# Altium schematic sheet PS_Controle_ADC-LED.SchDoc
size 449 x 320 mm
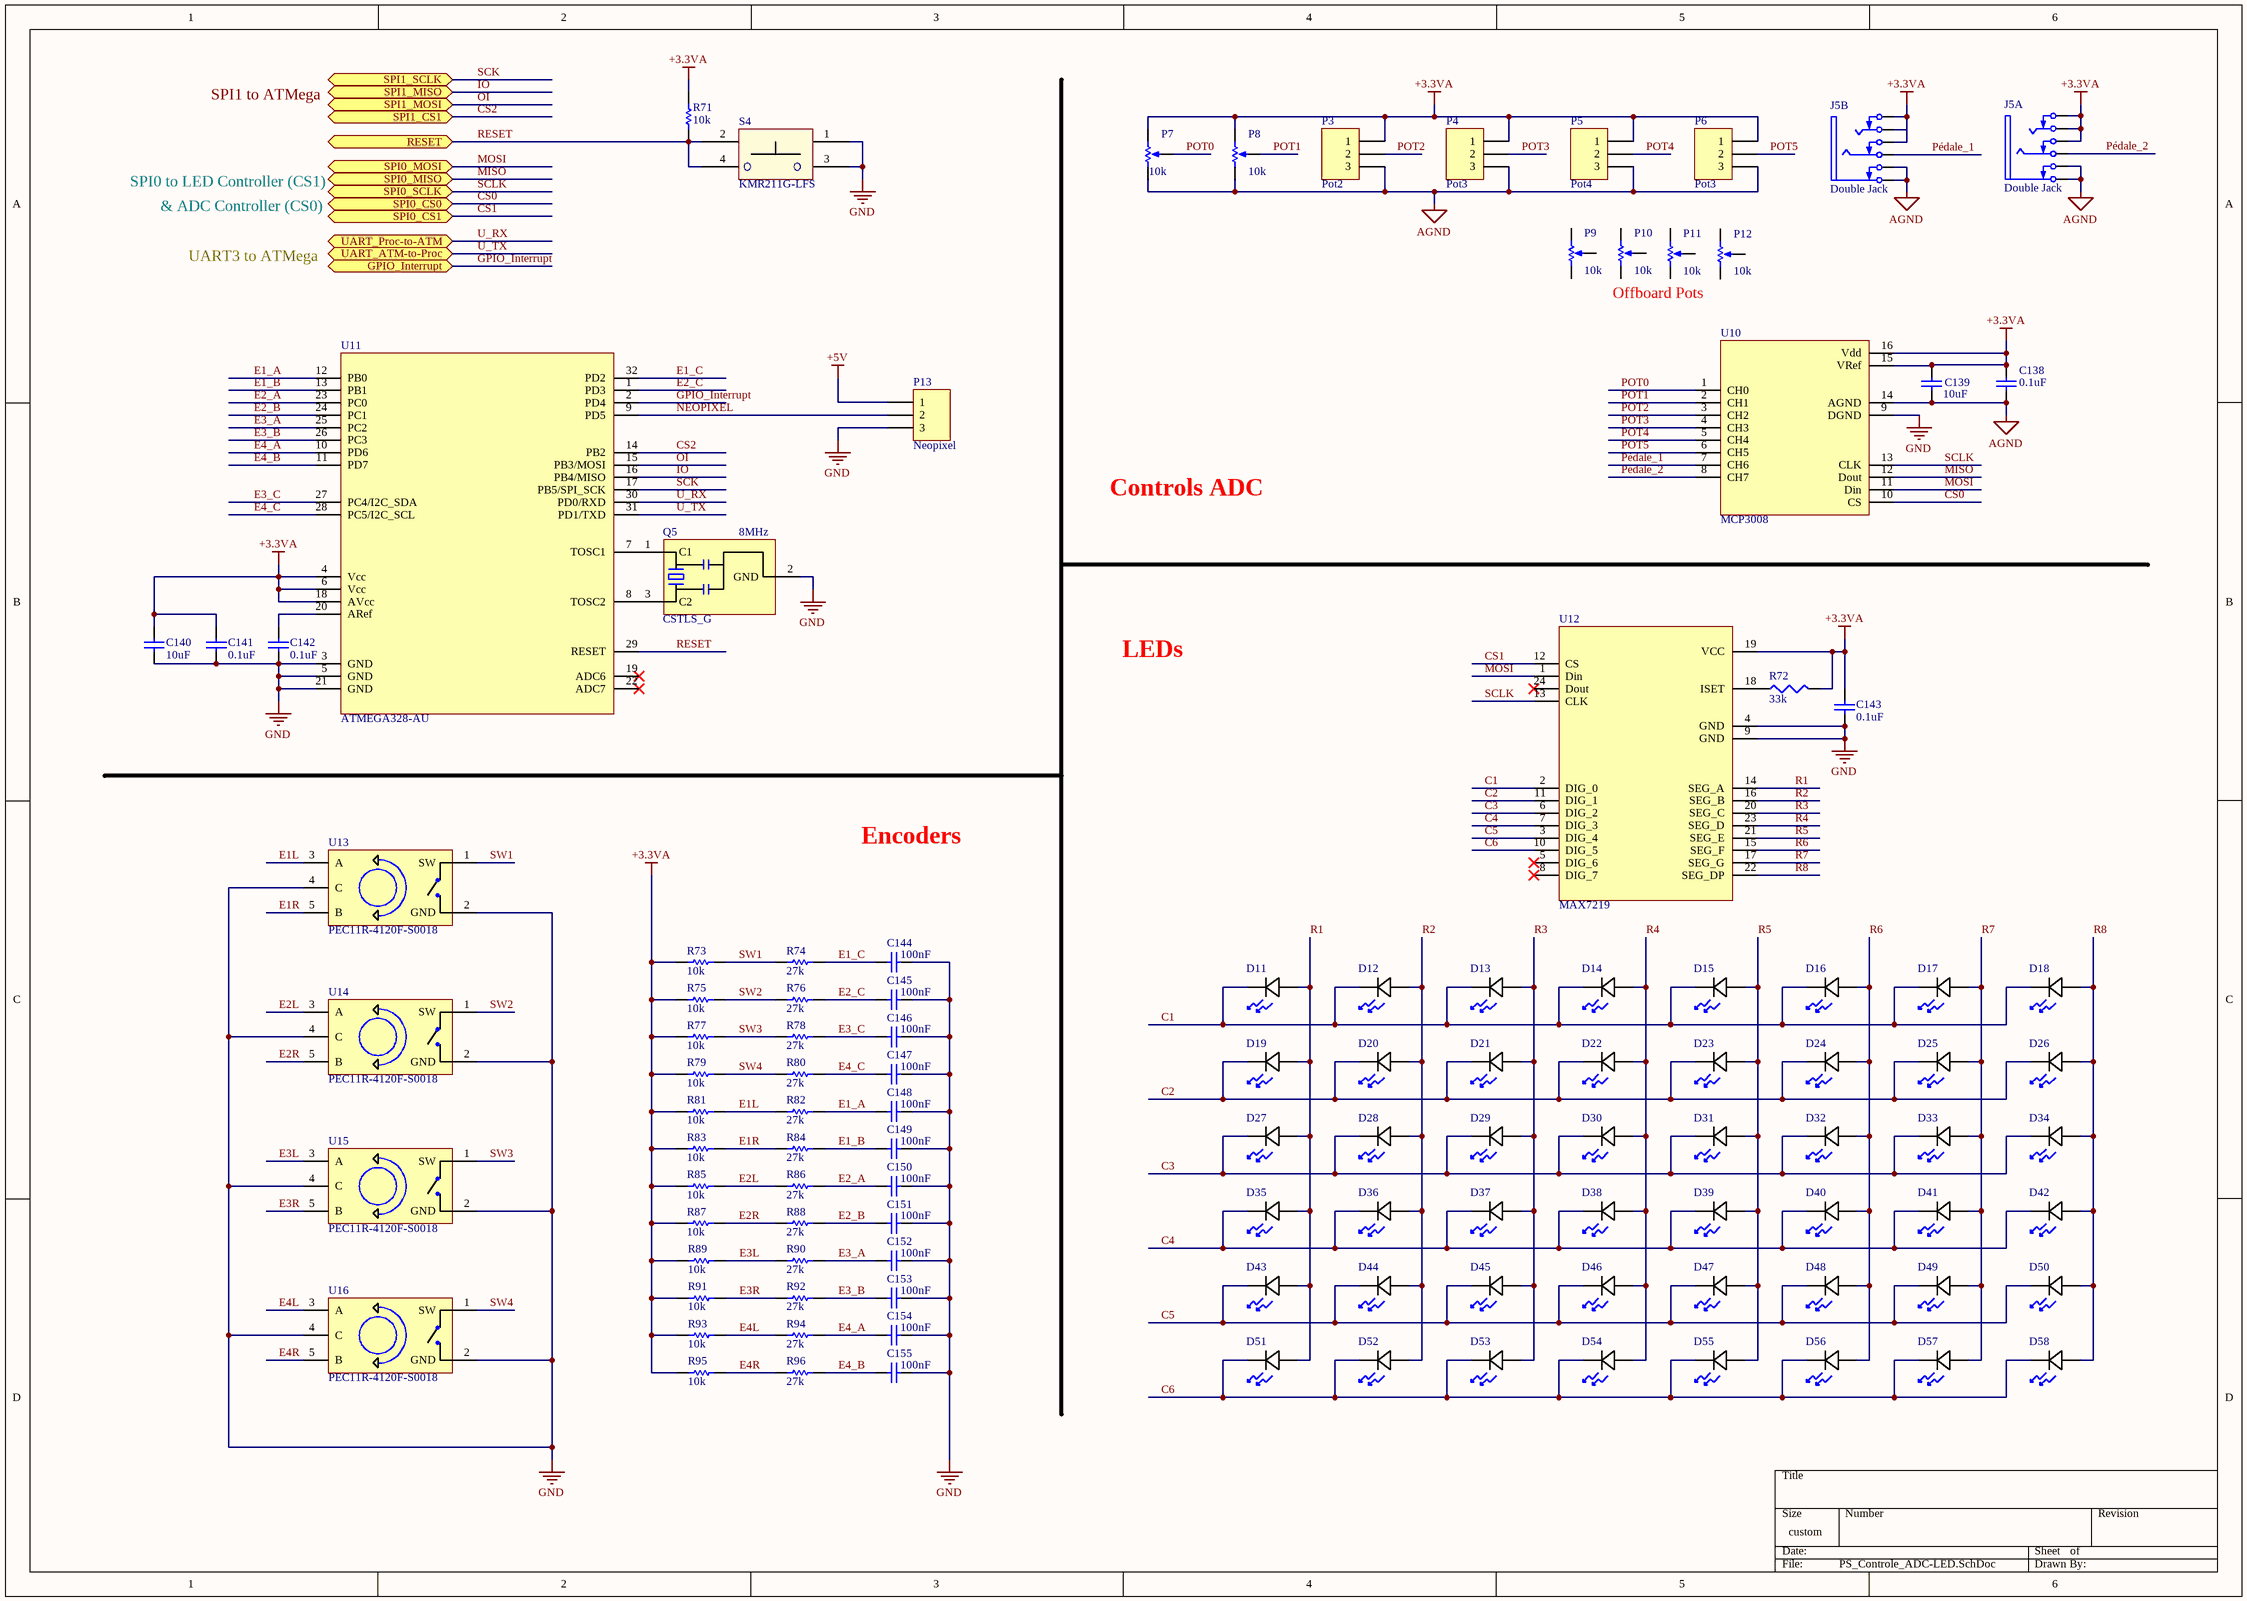
[diagram p0: PS_Controle_ADC-LED.SchDoc]

## Parts
C138  0.1uF  [CAPC1608X08]
C139  10uF  [CAPC1608X08]
C140  value 10uF  [CAPC1608X08]  (hidden comment: Cap)
C141  value 0.1uF  [CAPC1608X08]  (hidden comment: Cap)
C142  value 0.1uF  [CAPC1608X08]  (hidden comment: Cap)
C143  value 0.1uF  [CAPC1608X08]  (hidden comment: Cap)
C144  value 100nF  [CAPC1608X08]  (hidden comment: Cap)
C145  value 100nF  [CAPC1608X08]  (hidden comment: Cap)
C146  value 100nF  [CAPC1608X08]  (hidden comment: Cap)
C147  value 100nF  [CAPC1608X08]  (hidden comment: Cap)
C148  value 100nF  [CAPC1608X08]  (hidden comment: Cap)
C149  value 100nF  [CAPC1608X08]  (hidden comment: Cap)
C150  value 100nF  [CAPC1608X08]  (hidden comment: Cap)
C151  value 100nF  [CAPC1608X08]  (hidden comment: Cap)
C152  value 100nF  [CAPC1608X08]  (hidden comment: Cap)
C153  value 100nF  [CAPC1608X08]  (hidden comment: Cap)
C154  value 100nF  [CAPC1608X08]  (hidden comment: Cap)
C155  value 100nF  [CAPC1608X08]  (hidden comment: Cap)
D11  LNJ937W8CRA  [LED_LNJ]  (value not drawn)
D12  LNJ937W8CRA  [LED_LNJ]  (value not drawn)
D13  LNJ937W8CRA  [LED_LNJ]  (value not drawn)
D14  LNJ937W8CRA  [LED_LNJ]  (value not drawn)
D15  LNJ937W8CRA  [LED_LNJ]  (value not drawn)
D16  LNJ937W8CRA  [LED_LNJ]  (value not drawn)
D17  LNJ937W8CRA  [LED_LNJ]  (value not drawn)
D18  LNJ937W8CRA  [LED_LNJ]  (value not drawn)
D19  LNJ937W8CRA  [LED_LNJ]  (value not drawn)
D20  LNJ937W8CRA  [LED_LNJ]  (value not drawn)
D21  LNJ937W8CRA  [LED_LNJ]  (value not drawn)
D22  LNJ937W8CRA  [LED_LNJ]  (value not drawn)
D23  LNJ937W8CRA  [LED_LNJ]  (value not drawn)
D24  LNJ937W8CRA  [LED_LNJ]  (value not drawn)
D25  LNJ937W8CRA  [LED_LNJ]  (value not drawn)
D26  LNJ937W8CRA  [LED_LNJ]  (value not drawn)
D27  LNJ937W8CRA  [LED_LNJ]  (value not drawn)
D28  LNJ937W8CRA  [LED_LNJ]  (value not drawn)
D29  LNJ937W8CRA  [LED_LNJ]  (value not drawn)
D30  LNJ937W8CRA  [LED_LNJ]  (value not drawn)
D31  LNJ937W8CRA  [LED_LNJ]  (value not drawn)
D32  LNJ937W8CRA  [LED_LNJ]  (value not drawn)
D33  LNJ937W8CRA  [LED_LNJ]  (value not drawn)
D34  LNJ937W8CRA  [LED_LNJ]  (value not drawn)
D35  LNJ937W8CRA  [LED_LNJ]  (value not drawn)
D36  LNJ937W8CRA  [LED_LNJ]  (value not drawn)
D37  LNJ937W8CRA  [LED_LNJ]  (value not drawn)
D38  LNJ937W8CRA  [LED_LNJ]  (value not drawn)
D39  LNJ937W8CRA  [LED_LNJ]  (value not drawn)
D40  LNJ937W8CRA  [LED_LNJ]  (value not drawn)
D41  LNJ937W8CRA  [LED_LNJ]  (value not drawn)
D42  LNJ937W8CRA  [LED_LNJ]  (value not drawn)
D43  LNJ937W8CRA  [LED_LNJ]  (value not drawn)
D44  LNJ937W8CRA  [LED_LNJ]  (value not drawn)
D45  LNJ937W8CRA  [LED_LNJ]  (value not drawn)
D46  LNJ937W8CRA  [LED_LNJ]  (value not drawn)
D47  LNJ937W8CRA  [LED_LNJ]  (value not drawn)
D48  LNJ937W8CRA  [LED_LNJ]  (value not drawn)
D49  LNJ937W8CRA  [LED_LNJ]  (value not drawn)
D50  LNJ937W8CRA  [LED_LNJ]  (value not drawn)
D51  LNJ937W8CRA  [LED_LNJ]  (value not drawn)
D52  LNJ937W8CRA  [LED_LNJ]  (value not drawn)
D53  LNJ937W8CRA  [LED_LNJ]  (value not drawn)
D54  LNJ937W8CRA  [LED_LNJ]  (value not drawn)
D55  LNJ937W8CRA  [LED_LNJ]  (value not drawn)
D56  LNJ937W8CRA  [LED_LNJ]  (value not drawn)
D57  LNJ937W8CRA  [LED_LNJ]  (value not drawn)
D58  LNJ937W8CRA  [LED_LNJ]  (value not drawn)
J5  Double Jack  [Amphenol_ACJS-MHDC]  (parts A,B of 2)
P3  Pot2  [CONN_1241150-3_T]
P4  Pot3  [CONN_1241150-3_T]
P5  Pot4  [CONN_1241150-3_T]
P6  Pot3  [CONN_1241150-3_T]
P7  value 10k  [ALPS_RK09K1130C79]  (hidden comment: RPot)
P8  value 10k  [ALPS_RK09K1130C79]  (hidden comment: RPot)
P9  value 10k  (hidden comment: RPot)
P10  value 10k  (hidden comment: RPot)
P11  value 10k  (hidden comment: RPot)
P12  value 10k  (hidden comment: RPot)
P13  Neopixel  [CONN_1241150-3_T]
Q5  CSTLS_G  value 8MHz  [CSTCC_G]
R71  value 10k  [RESC1608X05]  (hidden comment: Res1)
R72  33k  [RESC1608X05]
R73  value 10k  [RESC1608X05]  (hidden comment: Res1)
R74  value 27k  [RESC1608X05]  (hidden comment: Res1)
R75  value 10k  [RESC1608X05]  (hidden comment: Res1)
R76  value 27k  [RESC1608X05]  (hidden comment: Res1)
R77  value 10k  [RESC1608X05]  (hidden comment: Res1)
R78  value 27k  [RESC1608X05]  (hidden comment: Res1)
R79  value 10k  [RESC1608X05]  (hidden comment: Res1)
R80  value 27k  [RESC1608X05]  (hidden comment: Res1)
R81  value 10k  [RESC1608X05]  (hidden comment: Res1)
R82  value 27k  [RESC1608X05]  (hidden comment: Res1)
R83  value 10k  [RESC1608X05]  (hidden comment: Res1)
R84  value 27k  [RESC1608X05]  (hidden comment: Res1)
R85  value 10k  [RESC1608X05]  (hidden comment: Res1)
R86  value 27k  [RESC1608X05]  (hidden comment: Res1)
R87  value 10k  [RESC1608X05]  (hidden comment: Res1)
R88  value 27k  [RESC1608X05]  (hidden comment: Res1)
R89  value 10k  [RESC1608X05]  (hidden comment: Res1)
R90  value 27k  [RESC1608X05]  (hidden comment: Res1)
R91  value 10k  [RESC1608X05]  (hidden comment: Res1)
R92  value 27k  [RESC1608X05]  (hidden comment: Res1)
R93  value 10k  [RESC1608X05]  (hidden comment: Res1)
R94  value 27k  [RESC1608X05]  (hidden comment: Res1)
R95  value 10k  [RESC1608X05]  (hidden comment: Res1)
R96  value 27k  [RESC1608X05]  (hidden comment: Res1)
S4  KMR211G-LFS  [C&K_KMR211G]
U10  MCP3008  [SOIC16_MCP3008]
U11  ATMEGA328-AU  [32A-M]
U12  MAX7219  [21-0042B_24-M]
U13  PEC11R-4120F-S0018  [BOURNS_PEC11R-4120F-S0018]
U14  PEC11R-4120F-S0018  [BOURNS_PEC11R-4120F-S0018]
U15  PEC11R-4120F-S0018  [BOURNS_PEC11R-4120F-S0018]
U16  PEC11R-4120F-S0018  [BOURNS_PEC11R-4120F-S0018]

## Ports
GPIO_Interrupt, RESET, SPI0_CS0, SPI0_CS1, SPI0_MISO, SPI0_MOSI, SPI0_SCLK, SPI1_CS1, SPI1_MISO, SPI1_MOSI, SPI1_SCLK, UART_ATM-to-Proc, UART_Proc-to-ATM

## Nets
+3.3VA: C138.1 C139.1 C140.1 C141.1 C143.1 J5.2(RB) J5.3(TB) J5.6(T) J5.8(RB) J5.9(TB) J5.12(T) P3.1 P4.1 P5.1 P6.1 P7.2(BOT) P8.2(BOT) R71.1 R72.2 R73.1 R75.1 R77.1 R79.1 R81.1 R83.1 R85.1 R87.1 R89.1 R91.1 R93.1 R95.1 U10.15(VRef) U10.16(Vdd) U11.4(Vcc) U11.6(Vcc) U11.18(AVcc) U12.19(VCC)
+5V: P13.1
AGND: C138.2 C139.2 J5.1(SB) J5.4(S) J5.7(SB) J5.10(S) P3.3 P4.3 P5.3 P6.3 P7.1(TOP) P8.1(TOP) U10.14(AGND)
GND: C140.2 C141.2 C142.2 C143.2 C144.1 C145.1 C146.1 C147.1 C148.1 C149.1 C150.1 C151.1 C152.1 C153.1 C154.1 C155.1 P13.3 Q5.2(GND) S4.1 S4.3 U10.9(DGND) U11.3(GND) U11.5(GND) U11.21(GND) U12.4(GND) U12.9(GND) U13.2(GND) U13.4(C) U14.2(GND) U14.4(C) U15.2(GND) U15.4(C) U16.2(GND) U16.4(C)
C1: D11.1 D12.1 D13.1 D14.1 D15.1 D16.1 D17.1 D18.1 U12.2(DIG_0)
C2: D19.1 D20.1 D21.1 D22.1 D23.1 D24.1 D25.1 D26.1 U12.11(DIG_1)
C3: D27.1 D28.1 D29.1 D30.1 D31.1 D32.1 D33.1 D34.1 U12.6(DIG_2)
C4: D35.1 D36.1 D37.1 D38.1 D39.1 D40.1 D41.1 D42.1 U12.7(DIG_3)
C5: D43.1 D44.1 D45.1 D46.1 D47.1 D48.1 D49.1 D50.1 U12.3(DIG_4)
C6: D51.1 D52.1 D53.1 D54.1 D55.1 D56.1 D57.1 D58.1 U12.10(DIG_5)
CS0: U10.10(CS) ; port SPI0_CS0
CS1: U12.12(CS) ; port SPI0_CS1
CS2: U11.14(PB2) ; port SPI1_CS1
E1_A: C148.2 R82.2 U11.12(PB0)
E1_B: C149.2 R84.2 U11.13(PB1)
E1_C: C144.2 R74.2 U11.32(PD2)
E1L: R81.2 R82.1 U13.3(A)
E1R: R83.2 R84.1 U13.5(B)
E2_A: C150.2 R86.2 U11.23(PC0)
E2_B: C151.2 R88.2 U11.24(PC1)
E2_C: C145.2 R76.2 U11.1(PD3)
E2L: R85.2 R86.1 U14.3(A)
E2R: R87.2 R88.1 U14.5(B)
E3_A: C152.2 R90.2 U11.25(PC2)
E3_B: C153.2 R92.2 U11.26(PC3)
E3_C: C146.2 R78.2 U11.27(PC4/I2C_SDA)
E3L: R89.2 R90.1 U15.3(A)
E3R: R91.2 R92.1 U15.5(B)
E4_A: C154.2 R94.2 U11.10(PD6)
E4_B: C155.2 R96.2 U11.11(PD7)
E4_C: C147.2 R80.2 U11.28(PC5/I2C_SCL)
E4L: R93.2 R94.1 U16.3(A)
E4R: R95.2 R96.1 U16.5(B)
GPIO_Interrupt: U11.2(PD4) ; port GPIO_Interrupt
IO: U11.16(PB4/MISO) ; port SPI1_MISO
MISO: U10.12(Dout) ; port SPI0_MISO
MOSI: U10.11(Din) U12.1(Din) ; port SPI0_MOSI
NEOPIXEL: P13.2 U11.9(PD5)
OI: U11.15(PB3/MOSI) ; port SPI1_MOSI
POT0: P7.3(TAP) U10.1(CH0)
POT1: P8.3(TAP) U10.2(CH1)
POT2: P3.2 U10.3(CH2)
POT3: P4.2 U10.4(CH3)
POT4: P5.2 U10.5(CH4)
POT5: P6.2 U10.6(CH5)
Pédale_1: J5.5(R) U10.7(CH6)
Pédale_2: J5.11(R) U10.8(CH7)
R1: D11.2 D19.2 D27.2 D35.2 D43.2 D51.2 U12.14(SEG_A)
R2: D12.2 D20.2 D28.2 D36.2 D44.2 D52.2 U12.16(SEG_B)
R3: D13.2 D21.2 D29.2 D37.2 D45.2 D53.2 U12.20(SEG_C)
R4: D14.2 D22.2 D30.2 D38.2 D46.2 D54.2 U12.23(SEG_D)
R5: D15.2 D23.2 D31.2 D39.2 D47.2 D55.2 U12.21(SEG_E)
R6: D16.2 D24.2 D32.2 D40.2 D48.2 D56.2 U12.15(SEG_F)
R7: D17.2 D25.2 D33.2 D41.2 D49.2 D57.2 U12.17(SEG_G)
R8: D18.2 D26.2 D34.2 D42.2 D50.2 D58.2 U12.22(SEG_DP)
RESET: R71.2 S4.2 S4.4 U11.29(RESET) ; port RESET
SCK: U11.17(PB5/SPI_SCK) ; port SPI1_SCLK
SCLK: U10.13(CLK) U12.13(CLK) ; port SPI0_SCLK
SW1: R73.2 R74.1 U13.1(SW)
SW2: R75.2 R76.1 U14.1(SW)
SW3: R77.2 R78.1 U15.1(SW)
SW4: R79.2 R80.1 U16.1(SW)
U_RX: U11.30(PD0/RXD) ; port UART_Proc-to-ATM
U_TX: U11.31(PD1/TXD) ; port UART_ATM-to-Proc
NetC142_1: C142.1 U11.20(ARef)
NetQ5_1: Q5.1(C1) U11.7(TOSC1)
NetQ5_3: Q5.3(C2) U11.8(TOSC2)
NetR72_1: R72.1 U12.18(ISET)

Not connected (* = marked no-connect by the designer): P9 1(TOP) 2(BOT) 3(TAP); P10 1(TOP) 2(BOT) 3(TAP); P11 1(TOP) 2(BOT) 3(TAP); P12 1(TOP) 2(BOT) 3(TAP); U11 19(ADC6)* 22(ADC7)*; U12 5(DIG_6)* 8(DIG_7)* 24(Dout)*

## Notes on the sheet
- SPI1 to ATMega
- & ADC Controller (CS0)
- SPI0 to LED Controller (CS1)
- UART3 to ATMega
- Offboard Pots
- Controls ADC
- LEDs
- Encoders

## Library data of the parts
C138 = Cap Semi: Capacitor (Semiconductor SIM Model); Fabricant: MURATA; Fournisseur: Farnell; RefFabricant: GRM188F51E104ZA01D; RefFournisseur: 2821272; Value: 0.1uF; Case: 0603 [1608 Metric]; DataSheet: http://www.farnell.com/datasheets/2048672.pdf
C139 = Cap Semi: Capacitor (Semiconductor SIM Model); Fabricant: MURATA; Fournisseur: Farnell; RefFabricant: GRM188R60J106ME47J; RefFournisseur: 2611921; Value: 10uF; Case: 0603 [1608 Metric]; DataSheet: http://www.farnell.com/datasheets/2079165.pdf
C140 = Cap: Capacitor; Fabricant: MURATA; Fournisseur: Farnell; RefFabricant: GRM188R60J106ME47J; RefFournisseur: 2611921; Case: 0603 [1608 Metric]; DataSheet: http://www.farnell.com/datasheets/2079165.pdf
C141-C143 = Cap: Capacitor; Fabricant: MURATA; Fournisseur: Farnell; RefFabricant: GRM188F51E104ZA01D; RefFournisseur: 2821272; Case: 0603 [1608 Metric]; DataSheet: http://www.farnell.com/datasheets/2048672.pdf
C144-C155 = Cap: Capacitor; Fabricant: MURATA; Fournisseur: Farnell; RefFabricant: GRM188F51E104ZA01D; RefFournisseur: 1828902; Case: 0603 [1608 Metric]; DataSheet: http://www.farnell.com/datasheets/2048672.pdf
D11-D18 = LNJ937W8CRA: LED Bleu; RefFournisseur: 1908058; Fabricant: PANASONIC ELECTRONIC COMPONENTS; Fournisseur: Farnell; RefFabricant: LNJ937W8CRA; DataSheet: http://www.farnell.com/datasheets/1915212.pdf
D19-D58 = LNJ937W8CRA: LED Bleu; Fabricant: PANASONIC ELECTRONIC COMPONENTS; Fournisseur: Farnell; RefFournisseur: 1908058; RefFabricant: LNJ937W8CRA; DataSheet: http://www.farnell.com/datasheets/1915212.pdf
J5 = Dual TRS Jack Bypassed: Dual Jack stereo bypassed; Fabricant: AMPHENOL; Fournisseur: Farnell; RefFabricant: ACJS-MHDC; RefFournisseur: 2771861; DataSheet: http://www.farnell.com/datasheets/866888.pdf
P3-P6 P13 = Header 3: Header, 3-Pin; Fabricant: AMP - TE CONNECTIVITY; Fournisseur: Farnell; RefFabricant: 1241150-3; RefFournisseur: 9689478; DataSheet: http://www.farnell.com/datasheets/318453.pdf
P7 P8 = RPot: Potentiometer; Fabricant: ALPS; Fournisseur: Farnell; RefFabricant: RK09K1130C79; RefFournisseur: 1191741; DataSheet: http://www.farnell.com/datasheets/2160634.pdf; Case: Through-Hole_5
P9-P12 = RPot: Potentiometer; Fabricant: Bi Technology; Fournisseur: Farnell; RefFabricant: P160KMP-0QC20B10K; RefFournisseur: 1760793; DataSheet: http://www.farnell.com/datasheets/2331843.pdf
Q5 = CSTLS_G: Ceramic Resonator; RefFabricant: CSTCC8M00G53-R0; Fabricant: MURATA; Fournisseur: Farnell; RefFournisseur: 1170435; DataSheet: http://www.farnell.com/datasheets/19296.pdf
R71 R73 R75 R77 R79 R81 R83 R85 R87 R89 R91 R93 R95 = Res1: Resistor; Fabricant: TE CONNECTIVITY; Fournisseur: Farnell; RefFabricant: CPF-A-0603B4K7E1; RefFournisseur: 2483933; Case: 0603 [1608 Metric]; DataSheet: http://www.farnell.com/datasheets/1935020.pdf
R72 = Res3: Resistor; Fabricant: TE CONNECTIVITY; Fournisseur: Farnell; RefFabricant: CPF-A-0603B33KE1; RefFournisseur: 2483920; Value: 33k; Case: 0603 [1608 Metric]
R74 R76 R78 R80 R82 R84 R86 R88 R90 R92 R94 R96 = Res1: Resistor; Fabricant: TE CONNECTIVITY; Fournisseur: Farnell; RefFabricant: CRGH0603F27K; RefFournisseur: 2332021; Case: 0603 [1608 Metric]; DataSheet: http://www.farnell.com/datasheets/1755795.pdf
S4 = KMR211G-LFS: Commutateur tactile; Fournisseur: Farnell; RefFournisseur: 1437635; RefFabricant: KMR211G LFS; Fabricant: C & K COMPONENTS; DataSheet: http://www.farnell.com/datasheets/2044619.pdf
U10 = MCP3008: 8 ADC Package SPI; RefFournisseur: 1292241; RefFabricant: MCP3008-I/SL; Fabricant: MICROCHIP; Fournisseur: Farnell; DataSheet: http://www.farnell.com/datasheets/808965.pdf
U11 = ATMEGA328-AU: Micro-contrôleur ATMEGA; Fournisseur: Farnell; RefFournisseur: 1972086; Fabricant: MicroChip; RefFabricant: ATMEGA328-AU; DataSheet: http://www.farnell.com/datasheets/2047852.pdf
U12 = MAX7219: LED_Controller; RefFabricant: MAX7219CWG+; Fabricant: MAXIM; RefFournisseur: 2519520; Fournisseur: Farnell; DataSheet: http://www.farnell.com/datasheets/1825883.pdf
U13-U16 = PEC11R-4120F-S0018: Encodeurs cliquables; RefFournisseur: 2663521; Fournisseur: Farnell; Fabricant: BOURNS; RefFabricant: PEC11R-4120F-S0018; DataSheet: http://www.farnell.com/datasheets/2360546.pdf; Case: Through-Hole_7